# EAGLE design amp (EAGLE 7.7.0)
CNAME: Direct coupled headphone amplifier; DESIGNER: Eugene Zagidullin

## Sheet 1 of 2
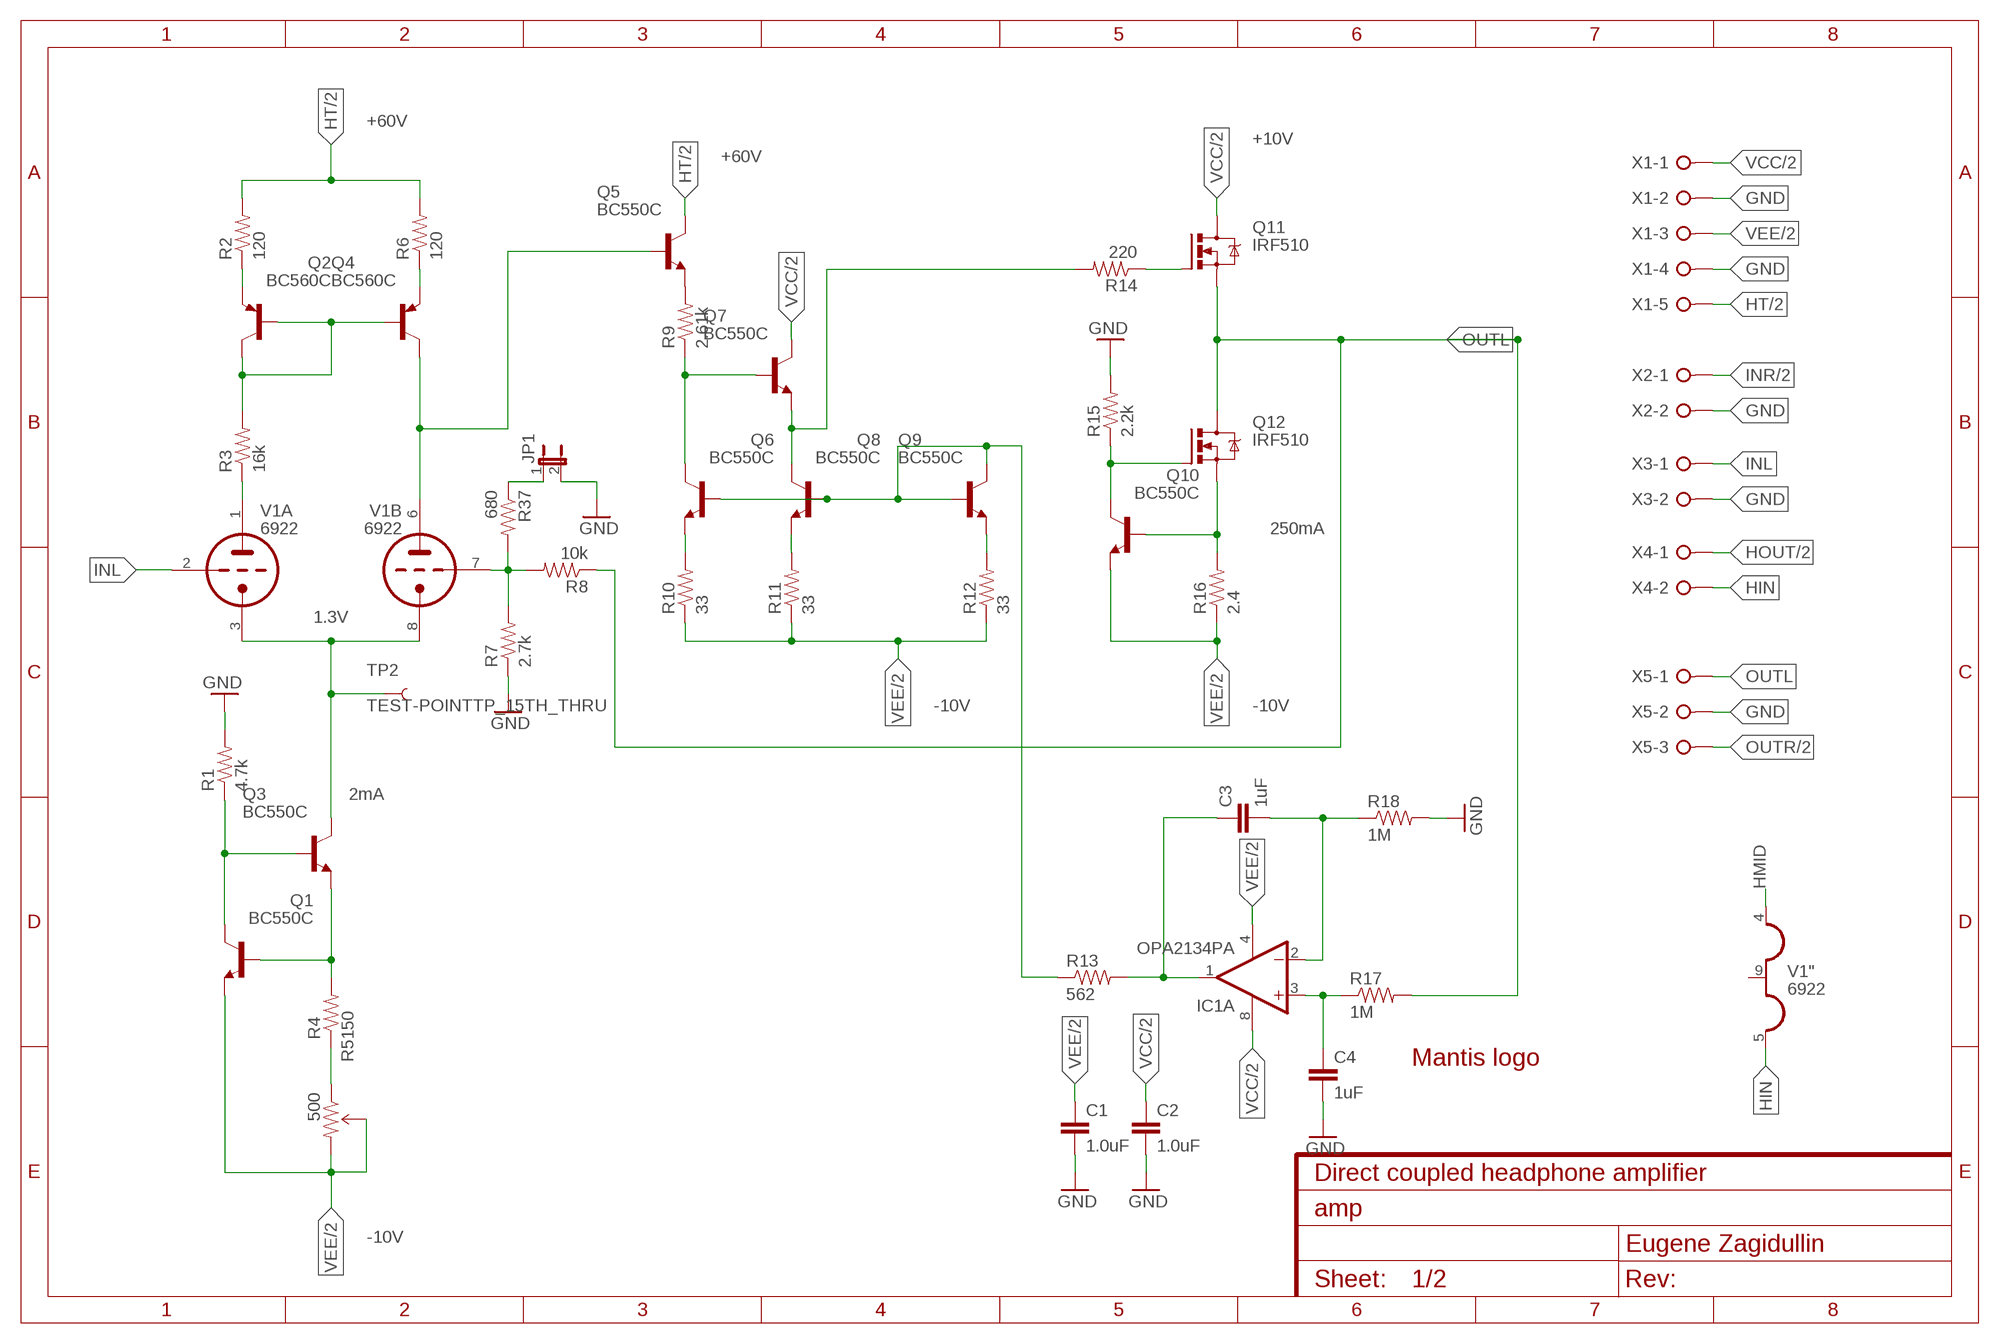
[diagram p0: schematic, sheet 1]

### Parts
C1  1.0uF  1.0UF-25V-+80/-20(0805)"  [0805-CAP]
C2  1.0uF  1.0UF-25V-+80/-20(0805)"  [0805-CAP]
C3  1uF  C5/5  [C5B5]
C4  1uF  C5/5  [C5B5]
IC1  OPA2134PA  [DIL08]
JP1  JUMPER-2PTH  [1X02]
LOGO1  LOGO-MANTIS  [LOGO-MANTIS]
Q1  BC550C  BC547  [TO92]
Q2  BC560C  BC556  [TO92-BENT]
Q3  BC550C  BC547  [TO92]
Q4  BC560C  BC556  [TO92-BENT]
Q5  BC550C  BC547  [TO92]
Q6  BC550C  BC547  [TO92]
Q7  BC550C  BC547  [TO92]
Q8  BC550C  BC547  [TO92]
Q9  BC550C  BC547  [TO92]
Q10  BC550C  BC547  [TO92]
Q11  IRF510  IRF540  [TO220BV]
Q12  IRF510  IRF540  [TO220BV]
R1  4.7k  RESISTORPTH-1/4W  [AXIAL-0.4]
R2  120  RESISTORPTH-1/4W  [AXIAL-0.4]
R3  16k  RESISTORPTH-1/4W  [AXIAL-0.4]
R4  150  RESISTORPTH-1/4W  [AXIAL-0.4]
R5  500  TRIMPOT3362U-2  [3362U-2]
R6  120  RESISTORPTH-1/4W  [AXIAL-0.4]
R7  2.7k  RESISTORPTH-1/4W  [AXIAL-0.4]
R8  10k  RESISTORPTH-1/4W  [AXIAL-0.4]
R9  2.61k  RESISTORPTH-1/4W  [AXIAL-0.4]
R10  33  RESISTORPTH-1/4W  [AXIAL-0.4]
R11  33  RESISTORPTH-1/4W  [AXIAL-0.4]
R12  33  RESISTORPTH-1/4W  [AXIAL-0.4]
R13  562  RESISTORPTH-1/4W  [AXIAL-0.4]
R14  220  RESISTORPTH-1/4W  [AXIAL-0.4]
R15  2.2k  RESISTORPTH-1/4W  [AXIAL-0.4]
R16  2.4  RESISTORPTH-1/2W  [AXIAL-0.5]
R17  1M  RESISTORPTH-1/4W  [AXIAL-0.4]
R18  1M  RESISTORPTH-1/4W  [AXIAL-0.4]
R37  680  RESISTORPTH-1/4W  [AXIAL-0.4]
TP2  TEST-POINTTP_15TH_THRU  [TP_15TH]
V1  6922  6922-P  [NOVAL]
X1  W237-05P  [W237-5P]
X2  W237-02P  [W237-132]
X3  W237-02P  [W237-132]
X4  W237-02P  [W237-132]
X5  W237-3E  [W237-3E]

### Nets
GND: C1.2 C2.2 C4.2 JP1.2 R1.P$2 R7.P$1 R15.P$2 R18.P$2 X1.2 X1.4 X2.2 X3.2 X5.2 ; also sheet 2
HIN: V1.5(":H3) X4.2
HMID: V1.4(":H1) ; also sheet 2
HOUT: X4.1 ; also sheet 2
HT [power]: Q5.3(C) R2.P$2 R6.P$2 X1.5 ; also sheet 2
INL: V1.2(A:TG) X3.1
INR: X2.1 ; also sheet 2
N$1: Q3.3(C) TP2.P$1 V1.3(A:TK) V1.8(B:TK)
N$2: Q2.1(C) Q2.2(B) Q4.2(B) R3.P$2
N$3: Q2.3(E) R2.P$1
N$4: Q4.1(C) Q5.2(B) V1.6(B:TA)
N$5: R3.P$1 V1.1(A:TA)
N$6: Q4.3(E) R6.P$1
N$7: Q1.2(B) Q3.1(E) R4.P$2
N$8: Q1.3(C) Q3.2(B) R1.P$1
N$9: R7.P$2 R8.P$2 R37.P$2 V1.7(B:TG)
N$10: Q6.2(B) Q8.2(B) Q9.2(B) Q9.3(C) R13.P$1
N$11: Q6.1(E) R10.P$2
N$12: Q9.1(E) R12.P$2
N$14: Q5.1(E) R9.P$2
N$15: Q10.3(C) Q12.G R15.P$1
N$16 [out]: Q10.2(B) Q12.S R16.P$2
N$17: C3.2 IC1.2(A:-IN) R18.P$1
N$19: C4.1 IC1.3(A:+IN) R17.P$1
N$21: C3.1 IC1.1(A:OUT) R13.P$2
N$32: Q8.1(E) R11.P$2
N$39: R4.P$1 R5.1(CCW)
N$41: Q11.G R14.P$1
N$44: Q6.3(C) Q7.2(B) R9.P$1
N$45: Q7.1(E) Q8.3(C) R14.P$2
N$47: JP1.1 R37.P$1
OUTL [out]: Q11.S Q12.D R8.P$1 R17.P$2 X5.1
OUTR [out]: X5.3 ; also sheet 2
VCC [power]: C2.1 IC1.8(A:V+) Q7.3(C) Q11.D X1.1 ; also sheet 2
VEE [power]: C1.1 IC1.4(A:V-) Q1.1(E) Q10.1(E) R5.2(WIPER) R5.3(CW) R10.P$1 R11.P$1 R12.P$1 R16.P$1 X1.3 ; also sheet 2
Unconnected: V1.9(":H2)

### Notes on the sheet
- +60V
- +10V
- +60V
- 250mA
- 1.3V
- -10V | -10V
- 2mA
- -10V

## Sheet 2 of 2
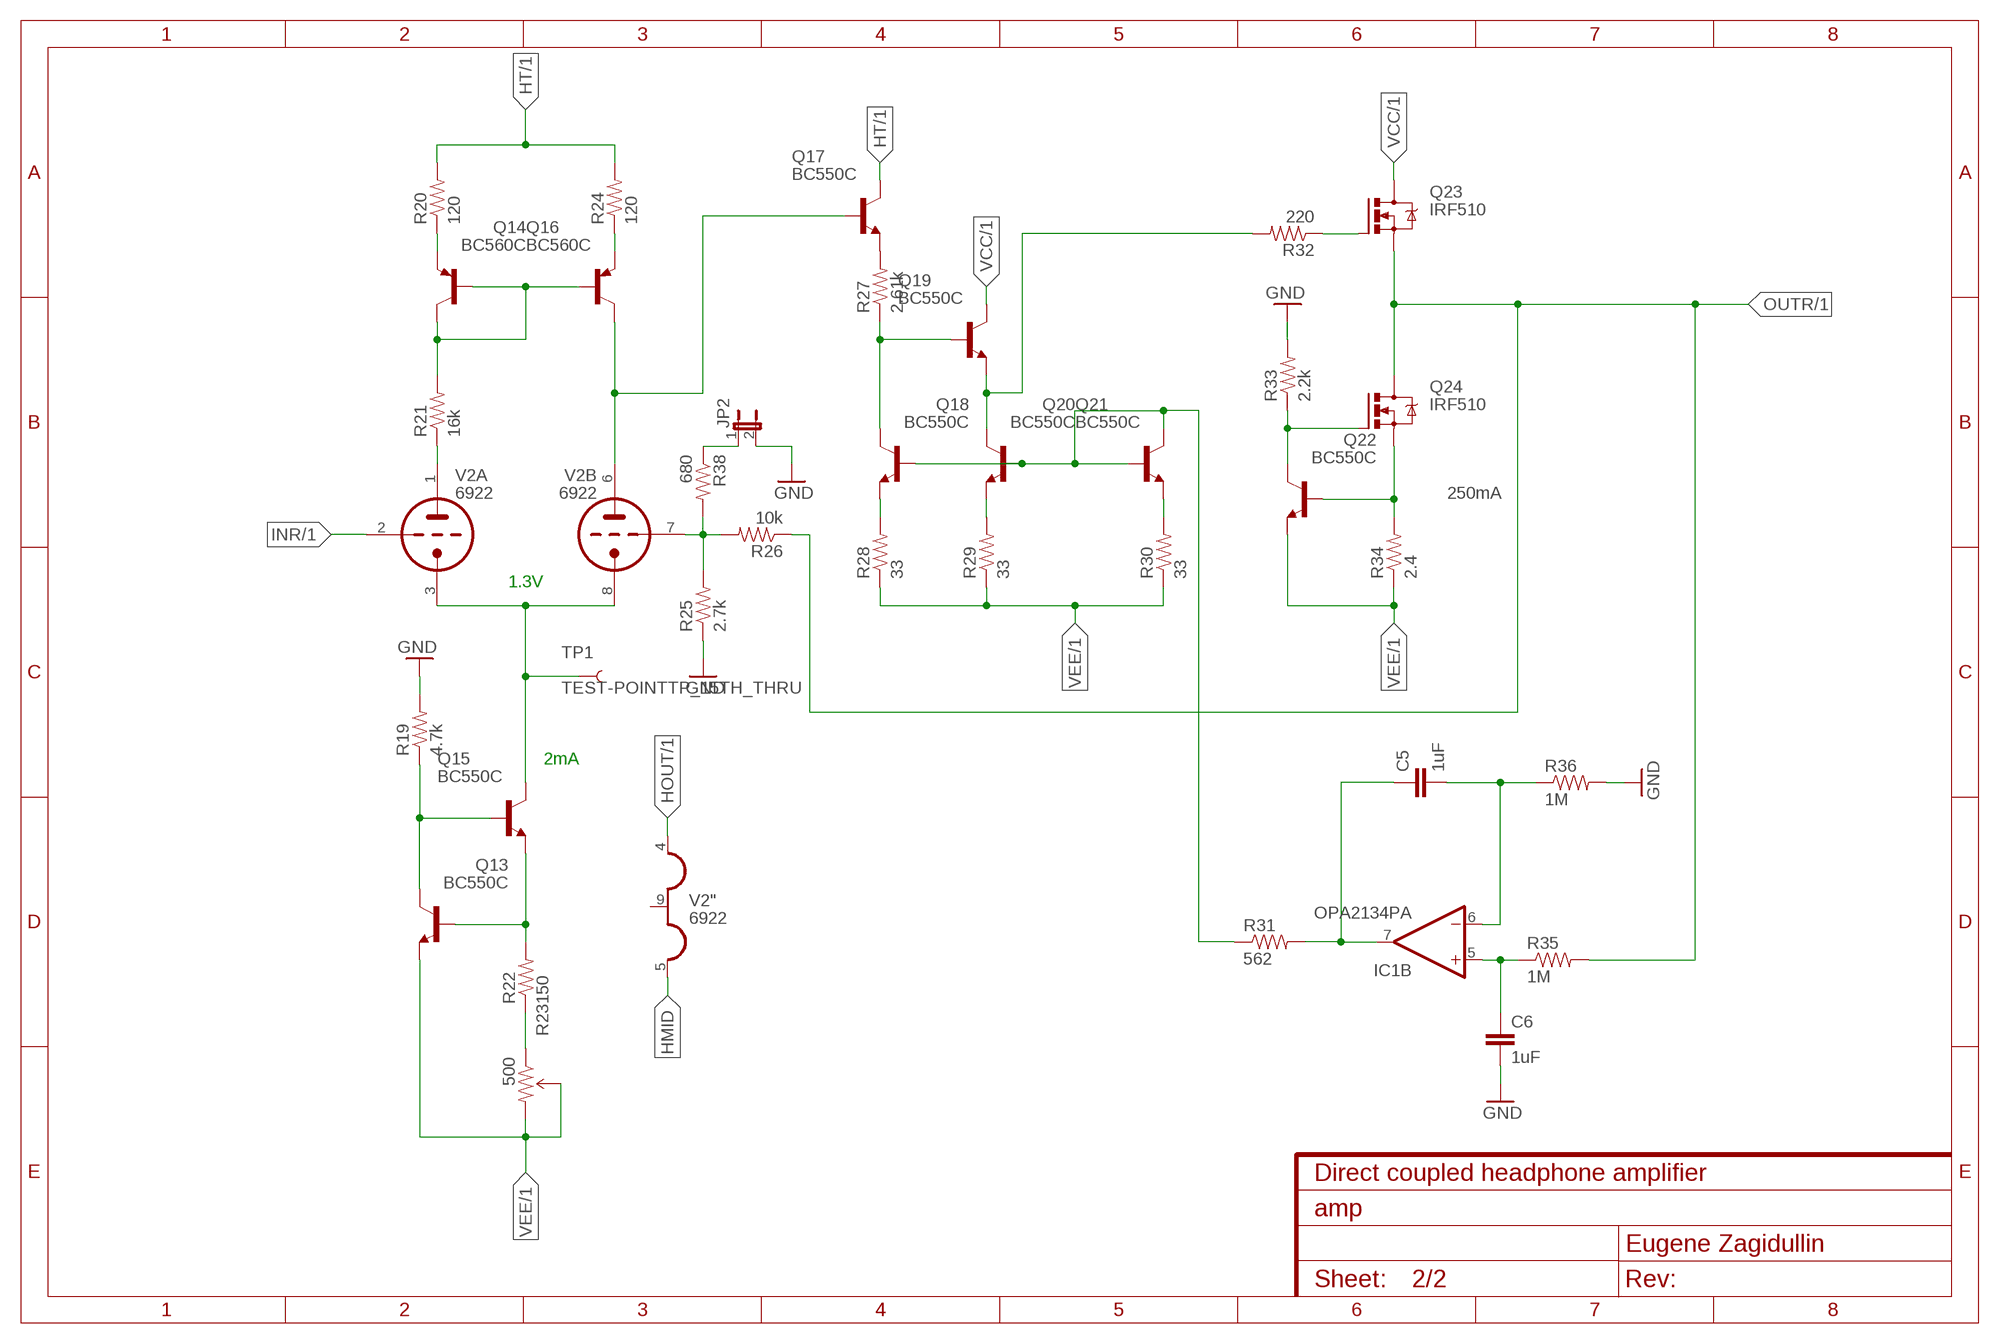
[diagram p1: schematic, sheet 2]

### Parts
C5  1uF  C5/5  [C5B5]
C6  1uF  C5/5  [C5B5]
JP2  JUMPER-2PTH  [1X02]
Q13  BC550C  BC547  [TO92]
Q14  BC560C  BC556  [TO92-BENT]
Q15  BC550C  BC547  [TO92]
Q16  BC560C  BC556  [TO92-BENT]
Q17  BC550C  BC547  [TO92]
Q18  BC550C  BC547  [TO92]
Q19  BC550C  BC547  [TO92]
Q20  BC550C  BC547  [TO92]
Q21  BC550C  BC547  [TO92]
Q22  BC550C  BC547  [TO92]
Q23  IRF510  IRF540  [TO220BV]
Q24  IRF510  IRF540  [TO220BV]
R19  4.7k  RESISTORPTH-1/4W  [AXIAL-0.4]
R20  120  RESISTORPTH-1/4W  [AXIAL-0.4]
R21  16k  RESISTORPTH-1/4W  [AXIAL-0.4]
R22  150  RESISTORPTH-1/4W  [AXIAL-0.4]
R23  500  TRIMPOT3362U-2  [3362U-2]
R24  120  RESISTORPTH-1/4W  [AXIAL-0.4]
R25  2.7k  RESISTORPTH-1/4W  [AXIAL-0.4]
R26  10k  RESISTORPTH-1/4W  [AXIAL-0.4]
R27  2.61k  RESISTORPTH-1/4W  [AXIAL-0.4]
R28  33  RESISTORPTH-1/4W  [AXIAL-0.4]
R29  33  RESISTORPTH-1/4W  [AXIAL-0.4]
R30  33  RESISTORPTH-1/4W  [AXIAL-0.4]
R31  562  RESISTORPTH-1/4W  [AXIAL-0.4]
R32  220  RESISTORPTH-1/4W  [AXIAL-0.4]
R33  2.2k  RESISTORPTH-1/4W  [AXIAL-0.4]
R34  2.4  RESISTORPTH-1/2W  [AXIAL-0.5]
R35  1M  RESISTORPTH-1/4W  [AXIAL-0.4]
R36  1M  RESISTORPTH-1/4W  [AXIAL-0.4]
R38  680  RESISTORPTH-1/4W  [AXIAL-0.4]
TP1  TEST-POINTTP_15TH_THRU  [TP_15TH]
V2  6922  6922-P  [NOVAL]

### Nets
GND: C6.2 JP2.2 R19.P$2 R25.P$1 R33.P$2 R36.P$2 ; also sheet 1
HMID: V2.5(":H3) ; also sheet 1
HOUT: V2.4(":H1) ; also sheet 1
HT [power]: Q17.3(C) R20.P$2 R24.P$2 ; also sheet 1
INR: V2.2(A:TG) ; also sheet 1
N$13: Q18.3(C) Q19.2(B) R27.P$1
N$18: Q15.3(C) TP1.P$1 V2.3(A:TK) V2.8(B:TK)
N$20: Q14.1(C) Q14.2(B) Q16.2(B) R21.P$2
N$22: Q16.1(C) Q17.2(B) V2.6(B:TA)
N$23: R21.P$1 V2.1(A:TA)
N$24: Q14.3(E) R20.P$1
N$25: Q16.3(E) R24.P$1
N$26: Q13.2(B) Q15.1(E) R22.P$2
N$27: Q13.3(C) Q15.2(B) R19.P$1
N$28: Q18.2(B) Q20.2(B) Q21.2(B) Q21.3(C) R31.P$1
N$29: Q18.1(E) R28.P$2
N$30: Q21.1(E) R30.P$2
N$31: Q19.1(E) Q20.3(C) R32.P$2
N$33: Q22.3(C) Q24.G R33.P$1
N$34 [out]: Q22.2(B) Q24.S R34.P$2
N$35: R25.P$2 R26.P$2 R38.P$2 V2.7(B:TG)
N$36: C5.2 IC1.6(B:-IN) R36.P$1
N$37: C6.1 IC1.5(B:+IN) R35.P$1
N$38: C5.1 IC1.7(B:OUT) R31.P$2
N$40: R22.P$1 R23.1(CCW)
N$42: Q23.G R32.P$1
N$43: Q17.1(E) R27.P$2
N$46: Q20.1(E) R29.P$2
N$48: JP2.1 R38.P$1
OUTR [out]: Q23.S Q24.D R26.P$1 R35.P$2 ; also sheet 1
VCC [power]: Q19.3(C) Q23.D ; also sheet 1
VEE [power]: Q13.1(E) Q22.1(E) R23.2(WIPER) R23.3(CW) R28.P$1 R29.P$1 R30.P$1 R34.P$1 ; also sheet 1
Unconnected: V2.9(":H2)

### Notes on the sheet
- 250mA
- 1.3V
- 2mA

## Library data of the parts
C1 C2 = SparkFun-Capacitors:1.0UF-25V-+80/-20(0805): CAP-11625; PROD_ID: CAP-11625
C3-C6 = capacitor-wima:C: CAPACITOR naming: grid - package width
IC1 = linear:OPA2*: Dual Operational Amplifier Low Power, Single-Supply, Rail-To-Rail Operational Amplifier Source: http://focus.ti.com/lit/ds/symlink/opa2345.pdf http://focus.ti.com .. opa241.pdf http://focus.ti.com/lit/ds/symlink/opa2134.pdf
JP1 JP2 = SparkFun-Retired:JUMPER-2: Jumper Basic 0.1" spaced jumper. Use with breakaway headers.
LOGO1 = my:LOGO-MANTIS: Mantis logo
Q1 Q3 Q5-Q10 Q13 Q15 Q17-Q22 = transistor-npn:BC547*: NPN Transistor
Q2 Q4 Q14 Q16 = my:BC556: PNP Transistror
Q11 Q12 Q23 Q24 = transistor-power:IRF540: HEXFET Power MOSFET
R1-R4 R6-R22 R24-R38 = SparkFun-Resistors:RESISTOR: Resistor Basic schematic elements and footprints for 0603, 1206, and PTH resistors.
R5 R23 = SparkFun-Electromechanical:TRIMPOT: Various small potentiometers for "set-and-forget" applications
TP1 TP2 = SparkFun-Passives:TEST-POINT: Bare copper test points for troubleshooting or ICT
V1 V2 = tubes:6922-P
X1 = con-wago-508:W237-05P: WAGO SREW CLAMP; OC_FARNELL: unknown; OC_NEWARK: unknown
X2-X4 = con-wago-508:W237-02P: WAGO SREW CLAMP; OC_FARNELL: unknown; OC_NEWARK: unknown
X5 = con-wago-508:W237-3E: WAGO SREW CLAMP; OC_FARNELL: unknown; OC_NEWARK: unknown

## Net classes
0 default: width 0.61 mm
1 power: width 1.27 mm, clearance 0.305 mm
2 out: width 1.016 mm

## Board
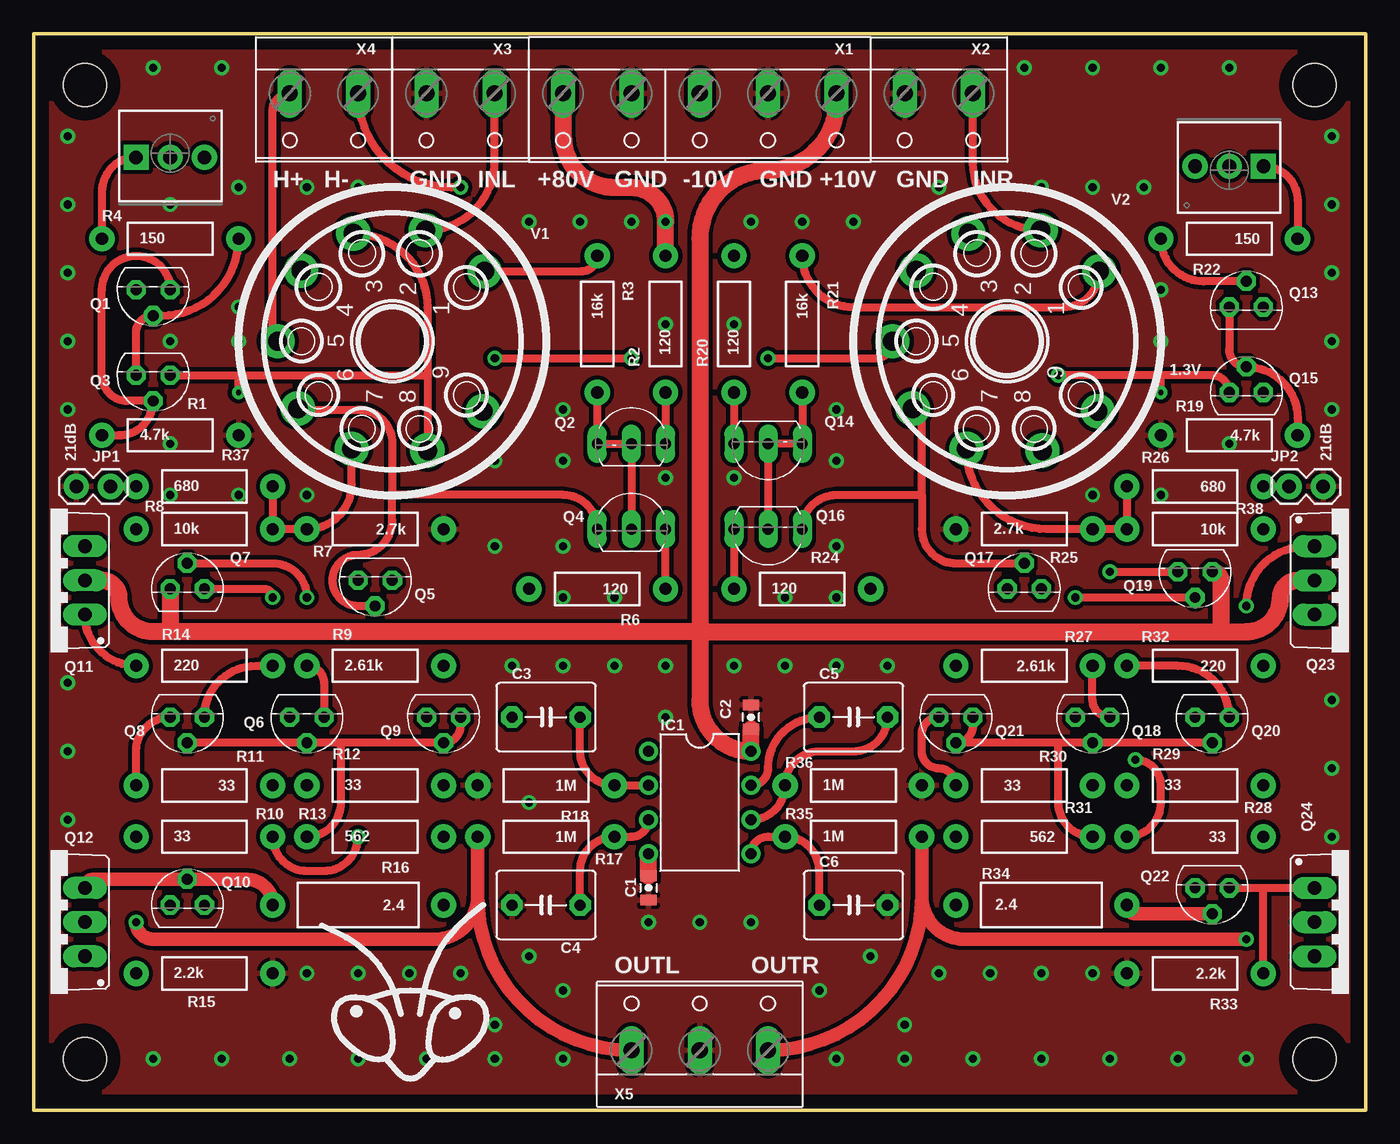
[diagram p2: board, top side]
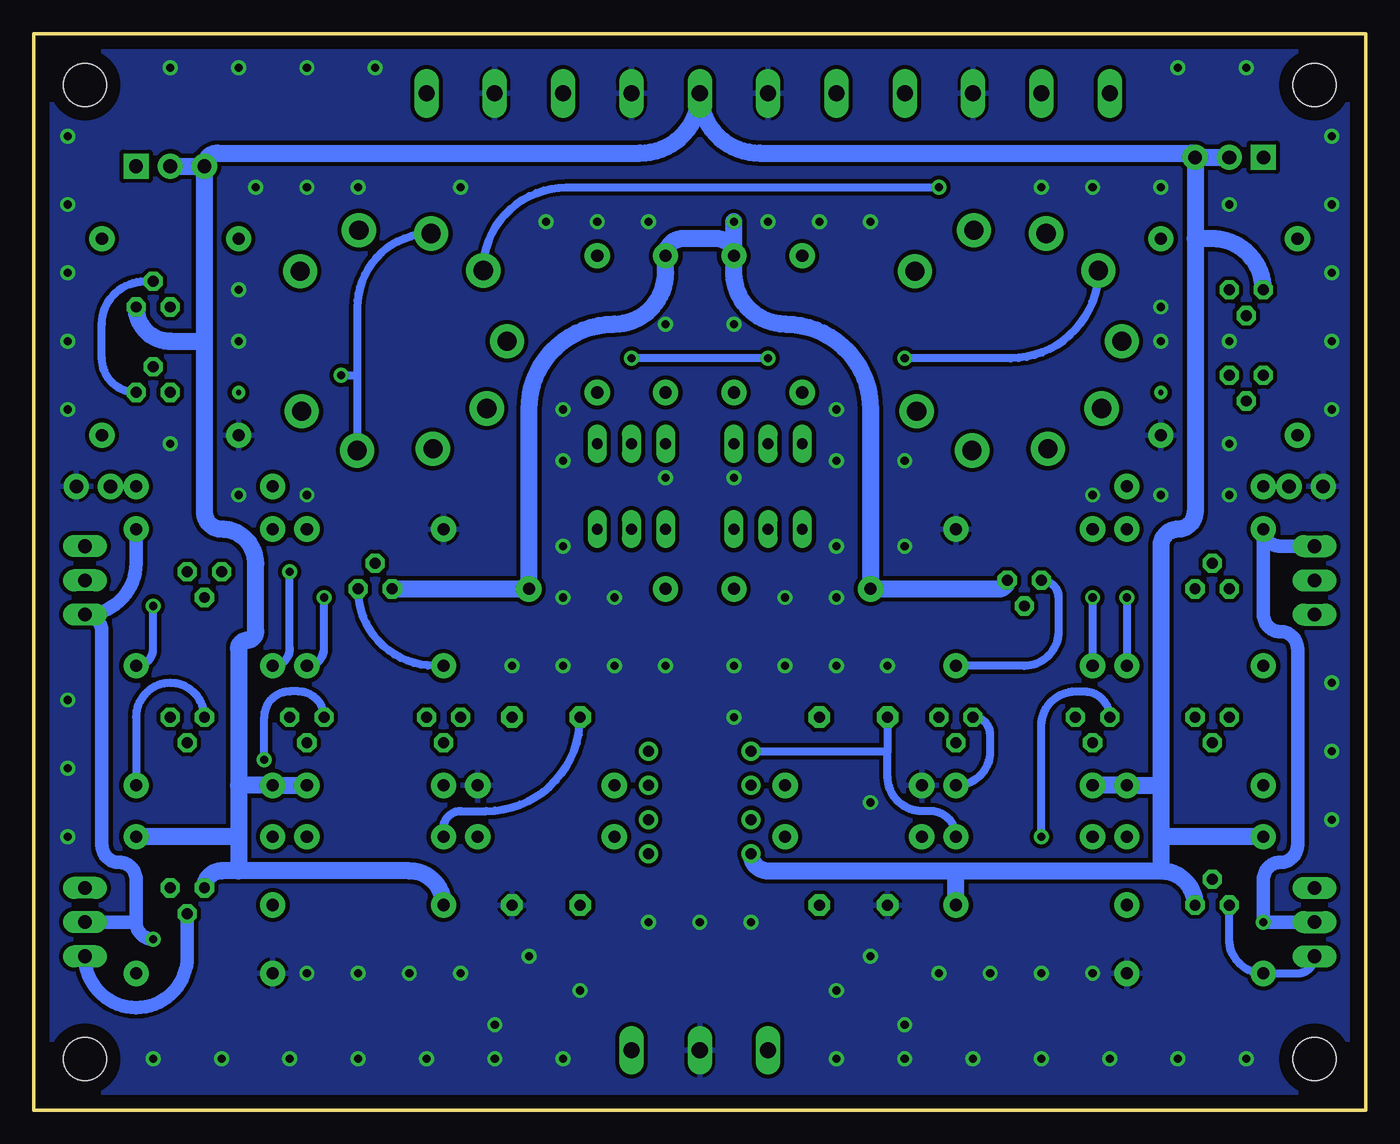
[diagram p3: board, bottom side, seen from below]

Size 99.06 x 80.01 mm. Coordinates in mm from the lower left corner, seen from the top.
Outline: 0,80.01 99.06,80.01 99.06,0 0,0 0,80.01
Copper layers (1*16): Top 0.035mm / dielectric 1.5mm / Bottom 0.035mm
Design rules "default *": minimum track width 10mil, minimum drill 12mil, track to track 12mil, track to pad 12mil, pad to pad 12mil, via to via 12mil, smd to smd 0mil, copper to edge 40mil, drill to drill 8mil, minimum pad ring 12mil, minimum via ring 10mil, stop-mask expansion 4mil, vias tented up to drill 0mil, thermal gap 10mil
Holes 3.2 mm at 3.81,76.2 3.81,3.81 95.25,3.81 95.25,76.2

### Footprints (pad centres in the part's own frame; a part is rotated, then mirrored left to right if it is on the bottom)
0805-CAP = smd 0.8 x 1.2: 1 -0.9,0; 2 0.9,0
C5B5 = drill 0.813 pad 1.6 octagon: 1 -2.54,0; 2 2.54,0
DIL08 = drill 0.813 pad 1.27: 1 -3.81,-3.81; 2 -1.27,-3.81; 3 1.27,-3.81; 4 3.81,-3.81; 5 3.81,3.81; 6 1.27,3.81; 7 -1.27,3.81; 8 -3.81,3.81
1X02 = drill 1.016 pad 1.88: 1 0,0; 2 2.54,0
TO92 = drill 0.813 octagon: 1 1.27,0; 2 0,1.905; 3 -1.27,0
TO92-BENT = drill 0.813 long: 1 -2.54,-1.27; 2 0,-1.27; 3 2.54,-1.27
TO220BV = drill 1.016 long: D 0,-2.54; G -2.54,-2.54; S 2.54,-2.54
AXIAL-0.4 = drill 0.9 pad 1.88: P$1 -5.08,0; P$2 5.08,0
3362U-2 = drill 1.016 pad 1.88 square: 1 -2.54,-0.305 | drill 1.016 pad 1.88: 2 0,-0.305; 3 2.54,-0.305
AXIAL-0.5 = drill 0.9 pad 1.88: P$1 -6.35,0; P$2 6.35,0
TP_15TH = drill 0.381 pad 0.61: P$1 0,0
NOVAL = drill 1.422 pad 2.54: 1 5.207,-6.858; 2 8.254,-2.484; 3 8.004,2.893; 4 5.258,6.77; 5 0,8.524; 6 -5.004,7.024; 7 -8.004,3.02; 8 -8.127,-2.611; 9 -5.207,-6.731
W237-5P = drill 1.194 long: 1 -10.16,-0.635; 2 -5.08,-0.635; 3 0,-0.635; 4 5.08,-0.635; 5 10.16,-0.635
W237-132 = drill 1.194 long: 1 -2.54,-0.635; 2 2.54,-0.635
W237-3E = drill 1.194 long: 1 -5.08,-0.635; 2 0,-0.635; 3 5.08,-0.635

### Placement (x,y rotation side)
C1  45.72,16.51 270 top
C2  53.34,29.21 90 top
C3  38.1,29.21 0 top
C4  38.1,15.24 180 top
C5  60.96,29.21 0 top
C6  60.96,15.24 0 top
IC1  49.53,22.86 270 top
JP1  5.71,46.35 180 top
JP2  93.34,46.35 0 top
LOGO1  27.94,8.89 0 top
Q1  8.89,60.96 180 top
Q2  44.45,50.8 0 top
Q3  8.89,54.61 180 top
Q4  44.45,44.45 0 top
Q5  25.4,39.37 180 top
Q6  20.32,29.21 180 top
Q7  11.43,38.73 0 top
Q8  11.43,29.21 180 top
Q9  30.48,29.21 180 top
Q10  11.43,15.24 0 top
Q11  1.27,39.37 90 top
Q12  1.27,13.97 90 top
Q13  90.17,59.69 0 top
Q14  54.61,48.26 180 top
Q15  90.17,53.34 0 top
Q16  54.61,41.91 180 top
Q17  73.66,38.73 0 top
Q18  78.74,29.21 180 top
Q19  86.36,40.01 180 top
Q20  87.63,29.21 180 top
Q21  68.58,29.21 180 top
Q22  87.63,16.51 180 top
Q23  97.79,39.37 270 top
Q24  97.79,13.97 270 top
R1  10.16,50.16 0 top
R2  46.99,58.42 90 top
R3  41.91,58.42 270 top
R4  10.16,64.77 0 top
R5  10.16,71.12 0 top
R6  41.91,38.73 180 top
R7  25.4,43.18 180 top
R8  12.7,43.18 0 top
R9  25.4,33.02 0 top
R10  12.7,20.32 0 top
R11  12.7,24.13 180 top
R12  25.4,24.13 0 top
R13  25.4,20.32 0 top
R14  12.7,33.02 0 top
R15  12.7,10.16 0 top
R16  24.13,15.24 180 top
R17  38.1,20.32 180 top
R18  38.1,24.13 180 top
R19  88.9,50.16 180 top
R20  52.07,58.42 90 top
R21  57.15,58.42 270 top
R22  88.9,64.77 180 top
R23  88.9,69.85 180 top
R24  57.15,38.73 0 top
R25  73.66,43.18 0 top
R26  86.36,43.18 180 top
R27  73.66,33.02 180 top
R28  86.36,20.32 180 top
R29  86.36,24.13 0 top
R30  73.66,24.13 180 top
R31  73.66,20.32 180 top
R32  86.36,33.02 180 top
R33  86.36,10.16 180 top
R34  74.93,15.24 0 top
R35  60.96,20.32 0 top
R36  60.96,24.13 0 top
R37  12.7,46.35 0 top
R38  86.36,46.35 180 top
TP1  83.82,53.34 0 top
TP2  15.24,53.34 0 top
V1  26.67,57.15 90 top
V2  72.39,57.15 90 top
X1  49.53,74.93 180 top
X2  67.31,74.93 180 top
X3  31.75,74.93 180 top
X4  21.59,74.93 180 top
X5  49.53,5.08 0 top

### Tracks (layer width: path | path; a pad name or v marks a point on that pad's centre or on a via)
GND  (via drill 0.6)
  other vias: 8.89,3.81 13.97,3.81 19.05,3.81 24.13,3.81 29.21,3.81 34.29,3.81 39.37,3.81 59.69,3.81 64.77,3.81 69.85,3.81 74.93,3.81 80.01,3.81 85.09,3.81 90.17,3.81 3.17,46.35 2.54,52.07 2.54,57.15 2.54,62.23 2.54,67.31 2.54,72.39 8.89,77.47 13.97,77.47 73.66,77.47 78.74,77.47 83.82,77.47 88.9,77.47 96.52,72.39 96.52,67.31 96.52,62.23 96.52,57.15 96.52,52.07 96.52,20.32 45.72,13.97 53.34,13.97 46.99,33.02 55.88,33.02 59.69,33.02 63.5,33.02 46.99,46.99 52.07,46.99 52.07,58.42 46.99,58.42 44.45,66.04 40.64,66.04 36.83,66.04 53.34,66.04 57.15,66.04 60.96,66.04 78.74,68.58 82.55,68.58 20.32,68.58 24.13,68.58 15.24,68.58 15.24,57.15 83.82,57.15 83.82,60.96 15.24,59.69 34.29,6.35 31.75,10.16 36.83,11.43 39.37,8.89 58.42,8.89 62.23,11.43 64.77,6.35 71.12,10.16 10.16,49.53 15.24,45.72 83.82,45.72 88.9,49.53 67.31,10.16 49.53,13.97 36.83,22.86 43.18,33.02 39.37,33.02 35.56,33.02 46.99,29.21 52.07,33.02 43.18,38.1 39.37,38.1 55.88,38.1 59.69,38.1 27.94,10.16 24.13,10.16 20.32,10.16 74.93,10.16 78.74,10.16 10.16,45.72 10.16,57.15 10.16,67.31 74.93,68.58 67.31,68.58 59.69,52.07 59.69,48.26 39.37,52.07 39.37,48.26 39.37,41.91 59.69,41.91 78.74,45.72 20.32,45.72 34.29,41.91 34.29,48.26 2.54,31.75 2.54,26.67 2.54,21.59 96.52,25.4 96.52,30.48
  pour Top (isolate 0.305): 0,80.01 99.06,80.01 99.06,0 0,0
  pour Bottom: 0,80.01 99.06,80.01 99.06,0 0,0
HIN
  Top 0.61: V1.5 arc-90 17.78,57.52 17.78,74.3 arc-90 X4.2
HMID  (via drill 0.6)
  Top 0.61: v34.29,55.88 v44.45,55.88 | v54.61,55.88 62.6,55.88 arc90 V2.5
  Bottom 0.61: V1.4 arc90 26.43,55.88 v34.29,55.88 | v44.45,55.88 v54.61,55.88
HOUT  (via drill 0.6)
  Top 0.61: v31.75,68.58 31.11,68.58 arc-90 X4.1
  Bottom 0.61: V2.4 arc90 59.45,68.58 v31.75,68.58
HT  (via drill 0.6)
  Top 1.27: R2.P$2 v46.99,66.04 arc90 44.45,68.58 43.18,68.58 arc-90 39.37,72.39 X1.5
  Bottom 1.27: R2.P$2 46.99,62.23 arc-90 43.18,58.42 arc90 36.83,52.07 R6.P$2 27.3,38.73 arc-90 Q5.3 | R2.P$2 v46.99,66.04 | R2.P$2 arc-90 48.26,64.77 50.8,64.77 arc-90 R20.P$2 52.07,62.23 arc90 55.88,58.42 arc-90 62.23,52.07 R24.P$2 Q17.3
INL
  Top 0.61: V1.2 arc90 34.29,70.54 X3.1
INR
  Top 0.61: V2.2 arc-90 69.85,70.43 X2.1
N$1
  Top 0.61: V1.3 arc-90 29.28,59.65 29.28,54.61 | 29.28,54.61 V1.8 | Q3.3 15.24,54.61 | 15.24,54.61 29.28,54.61 | TP2.P$1 15.24,54.61
N$2
  Top 0.61: R3.P$2 Q2.1 Q2.2 Q4.2
N$3
  Top 0.61: R2.P$1 Q2.3
N$4
  Top 0.61: V1.6 arc90 19.72,52.07 24.13,52.07 arc-90 26.67,49.53 26.67,45.72 | Q4.1 arc90 39.37,45.72 26.67,45.72 | Q5.2 24.13,37.47 arc-90 22.23,39.37 arc-90 24.13,41.27 arc90 26.67,43.81 26.67,45.72
N$5
  Top 0.61: V1.1 40.77,62.36 arc90 R3.P$1
N$6
  Top 0.61: R6.P$1 Q4.3
N$7
  Top 0.61: Q3.1 7.62,57.78 arc-90 Q1.2 9.53,59.05 arc90 R4.P$2
N$8
  Top 0.61: Q1.3 arc90 7.62,63.5 arc90 5.08,60.96 5.08,54.61 arc90 6.99,52.7 Q3.2 arc-90 6.35,50.16 R1.P$1
N$9
  Top 0.61: V1.7 23.65,46.51 arc-90 R7.P$2 R8.P$2 R37.P$2
N$10
  Top 0.61: Q9.3 31.75,28.57 arc-90 Q9.2 22.86,27.3 | 22.86,27.3 Q6.2 Q8.2 | R13.P$1 arc90 22.86,22.86 22.86,27.3
N$11  (via drill 0.6)
  Top 0.61: R10.P$2 arc90 20.32,17.78 21.59,17.78 arc90 v24.13,20.32
  Bottom 0.61: v24.13,20.32 24.13,28.57 arc90 21.59,31.11 20.95,31.11 arc90 Q6.1
N$12
  Bottom 0.61: Q9.1 arc90 27.94,27.94 27.94,26.67 arc90 R12.P$2
N$13  (via drill 0.6)
  Top 0.61: Q18.3 arc-90 78.74,30.48 R27.P$1 | v77.47,38.1 Q19.2
  Bottom 0.61: R27.P$1 arc-90 77.47,34.29 v77.47,38.1
N$14
  Bottom 0.61: Q5.1 arc90 22.86,38.1 22.86,35.56 arc90 25.4,33.02 R9.P$2
N$15
  Bottom 0.61: Q10.3 10.16,12.7 arc-90 R15.P$1 5.08,10.16 arc-90 Q12.G
N$16
  Top 1.016: R16.P$2 arc90 15.88,17.14 Q10.2 4.45,17.14 arc90 Q12.S
N$17
  Top 0.61: IC1.2 R18.P$1 arc-90 40.64,26.67 C3.2
N$18  (via drill 0.6)
  Top 0.61: Q15.3 arc90 87.63,54.61 83.82,54.61 | 83.82,54.61 v76.2,54.61 | TP1.P$1 83.82,54.61
  Bottom 0.61: V2.3 arc-90 75,59.65 75,54.61 | 75,54.61 V2.8 | v76.2,54.61 75,54.61
N$19
  Top 0.61: C4.1 40.64,17.78 arc-90 R17.P$1 44.45,20.32 arc90 IC1.3
N$20
  Top 0.61: R21.P$2 Q14.1 Q14.2 Q16.2
N$21
  Bottom 0.61: IC1.1 35.56,26.67 | C3.1 35.56,26.67 | R13.P$2 arc-90 32.38,22.23 33.02,22.23 arc90 35.56,24.77 35.56,26.67
N$22
  Top 0.61: 66.04,45.72 66.04,51.47 arc90 V2.6 | Q16.1 arc-90 59.69,45.72 66.04,45.72 | 66.04,45.72 66.04,43.18 arc90 68.58,40.64 Q17.2
N$23
  Top 0.61: R21.P$1 arc90 60.96,59.69 76.58,59.69 arc90 V2.1
N$24
  Top 0.61: R20.P$1 Q14.3
N$25
  Top 0.61: Q16.3 R24.P$1
N$26
  Top 0.61: Q13.2 87,61.59 arc-90 R22.P$2
  Bottom 0.61: Q15.1 arc90 93.98,55.88 93.98,58.42 arc90 90.81,61.59 Q13.2
N$27
  Top 0.61: Q13.3 88.9,56.52 arc90 Q15.2 arc-90 93.98,51.44 R19.P$1
N$28
  Top 0.61: Q20.2 Q18.2 76.2,27.3 | 76.2,27.3 Q21.2 arc90 69.85,28.57 Q21.3 | R31.P$1 arc-90 76.2,22.86 76.2,27.3
N$29  (via drill 0.6)
  Top 0.61: R28.P$2 arc90 83.82,22.86 83.82,24.13 arc90 v81.92,26.04
  Bottom 0.61: v81.92,26.04 81.92,29.21 arc90 80.01,31.11 79.38,31.11 arc90 Q18.1
N$30
  Top 0.61: Q21.1 arc90 66.04,27.94 66.04,26.67 arc90 67.31,25.4 arc-90 R30.P$2
N$31  (via drill 0.6)
  Top 0.61: Q20.3 arc90 85.09,33.02 R32.P$2 | v80.01,40.01 Q19.1
  Bottom 0.61: R32.P$2 arc-90 80.01,34.29 v80.01,40.01
N$32
  Top 0.61: R11.P$2 7.62,26.67 arc-90 Q8.1
N$33
  Top 0.61: Q22.3 91.44,16.51 | 91.44,16.51 Q24.G | R33.P$1 91.44,16.51
N$34
  Top 1.016: Q22.2 81.92,14.61 arc-90 R34.P$2
  Bottom 1.016: Q22.2 87.63,11.43 arc90 91.44,7.62 arc90 Q24.S
N$35
  Top 0.61: V2.7 arc90 75.34,43.18 R25.P$2 R26.P$2 R38.P$2
N$36
  Top 0.61: IC1.6 arc90 R36.P$1 arc-90 58.42,26.67 60.96,26.67 arc90 C5.2
N$37
  Top 0.61: C6.1 58.42,17.78 arc90 R35.P$1 54.61,20.32 arc90 IC1.5
N$38
  Top 0.61: IC1.7 arc90 54.61,25.4 arc-90 C5.1
  Bottom 0.61: R31.P$2 68.58,20.95 arc90 67.31,22.23 65.41,22.23 arc-90 C5.1
N$39
  Top 0.61: R5.1 arc90 5.08,68.28 R4.P$1
N$40
  Top 0.61: R23.1 arc-90 93.98,67.61 R22.P$1
N$41
  Top 0.61: R14.P$1 arc-90 Q11.G
N$42  (via drill 0.6)
  Top 0.61: v90.17,37.47 arc-90 94.61,41.91 Q23.G
  Bottom 0.61: R32.P$1 arc-90 90.17,34.29 v90.17,37.47
N$43
  Bottom 0.61: R27.P$2 69.22,33.02 arc90 Q17.1
N$44  (via drill 0.6)
  Top 0.61: R9.P$1 arc-90 21.59,31.75 Q6.3 | Q7.2 17.78,40.64 arc-90 v20.32,38.1
  Bottom 0.61: v20.32,38.1 R9.P$1
N$45  (via drill 0.6)
  Top 0.61: Q8.3 arc-90 16.51,33.02 R14.P$2 | Q7.1 17.14,38.73 arc-90 v17.78,38.1
  Bottom 0.61: v17.78,38.1 R14.P$2
N$46
  Bottom 0.61: R29.P$2 91.44,29.21 arc90 88.9,31.75 arc90 Q20.1
N$47
  Top 0.61: JP1.1 R37.P$1
N$48
  Top 0.61: R38.P$1 JP2.1
OUTL  (via drill 0.6)
  Top 1.016: R17.P$2 33.02,15.88 | 33.02,15.88 arc90 X5.1 | 33.02,15.88 arc-90 29.84,12.7 8.89,12.7 arc-90 v7.62,13.97
  Bottom 1.016: Q11.S 6.35,41.91 arc90 R8.P$1 7.62,36.83 arc-90 6.35,35.56 arc90 5.08,34.29 5.08,19.68 arc90 6.35,18.41 arc-90 7.62,17.14 v7.62,13.97 Q12.D
OUTR  (via drill 0.6)
  Top 1.016: X5.3 arc90 66.04,15.88 | 66.04,15.88 R35.P$2 | v90.17,12.7 69.22,12.7 arc-90 66.04,15.88
  Bottom 1.016: 91.44,13.97 91.44,17.14 arc-90 92.71,18.41 arc90 93.98,19.68 93.98,35.56 arc-90 Q23.S arc-90 91.44,40.64 R26.P$1 | 91.44,13.97 arc-90 v90.17,12.7 | Q24.D 91.44,13.97
VCC
  Top 1.27: X1.1 59.69,74.93 arc-90 54.61,69.85 arc90 49.53,64.77 49.53,35.56 | 49.53,35.56 10.16,35.56 | Q7.3 10.16,35.56 | 49.53,35.56 88.27,35.56 | 88.27,35.56 90.17,35.56 arc90 92.71,38.1 arc-90 93.98,39.37 Q23.D | 49.53,35.56 49.53,30.48 arc90 IC1.8 C2.1 | 10.16,35.56 8.89,35.56 arc-90 6.35,38.1 arc90 5.08,39.37 Q11.D | Q19.3 arc-90 88.27,39.37 88.27,35.56
VEE
  Top 1.27: C1.1 IC1.4
  Bottom 1.27: R5.3 12.7,64.77 | R23.3 86.36,57.15 | IC1.4 arc-90 44.45,17.78 30.48,17.78 | R23.3 arc90 85.39,71.12 53.98,71.12 arc-90 X1.3 arc-90 45.09,71.12 13.01,71.12 arc90 R5.3 | Q13.1 arc-90 88.9,57.15 86.36,57.15 | R23.2 R23.3 | Q1.1 arc-90 11.43,64.77 12.7,64.77 | R5.3 R5.2 | 30.48,17.78 15.24,17.78 | 12.7,64.77 12.7,44.45 arc90 13.97,43.18 arc-90 15.24,41.91 15.24,24.13 | 15.24,24.13 15.24,20.32 | 15.24,20.32 15.24,17.78 | 15.24,17.78 arc90 Q10.1 | 15.24,24.13 R11.P$1 R12.P$1 | R16.P$1 30.48,17.78 | R10.P$1 15.24,20.32 | 86.36,57.15 86.36,44.45 arc-90 85.09,43.18 arc90 82.55,40.64 82.55,35.56 arc90 83.19,34.92 arc-90 83.82,34.29 83.82,24.13 | 83.82,24.13 83.82,20.32 | 83.82,20.32 R28.P$1 | R34.P$1 arc-90 71.12,17.78 83.82,17.78 | 83.82,17.78 85.09,17.78 arc-90 Q22.1 | 83.82,20.32 83.82,17.78 | 83.82,24.13 R29.P$1 R30.P$1

### Text on the board
tPlace: H+ | H- | GND | INL | +80V | GND | -10V | GND | +10V | GND | INR | 1.3V | 21dB | 21dB | OUTL | OUTR